# Altium project miStepper.PrjPcb
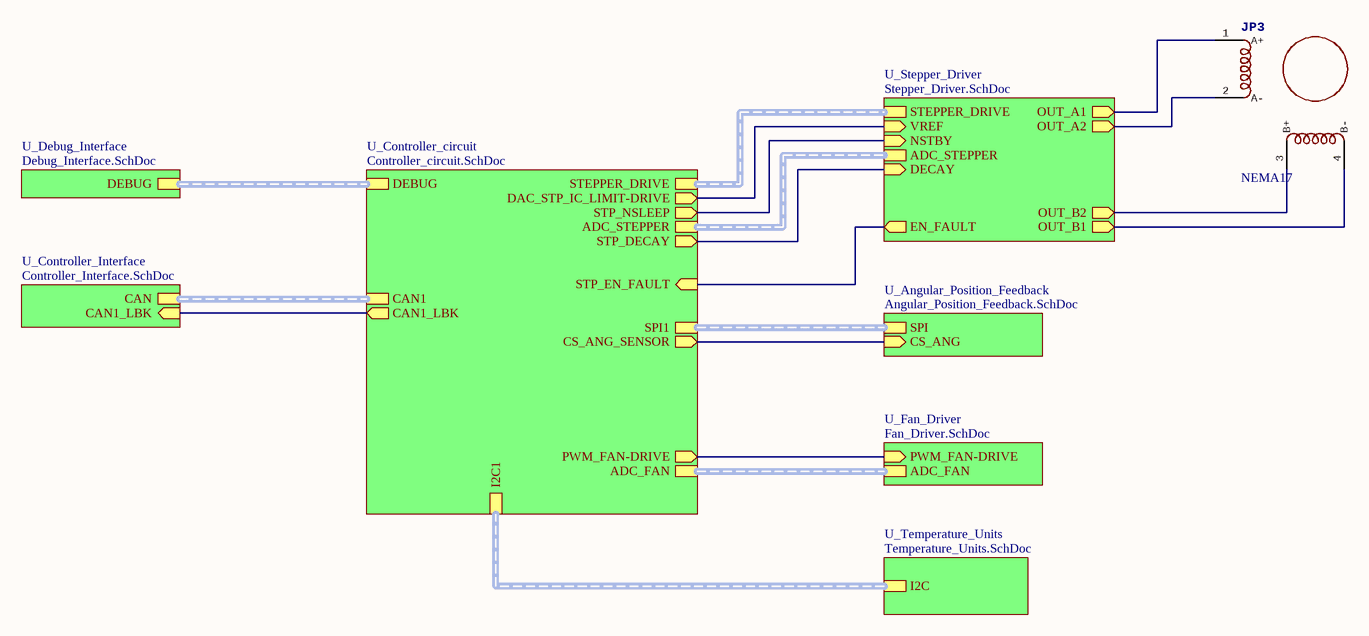
[diagram p0: Top_level.SchDoc]
9 sheets, 69 parts. Net scope: hierarchical (ports join the sheet entries above them; power ports are global).
Sheets:
  Top_level.SchDoc
    U_Controller_circuit = Controller_circuit.SchDoc
    U_Debug_Interface = Debug_Interface.SchDoc
    U_Controller_Interface = Controller_Interface.SchDoc
    U_Fan_Driver = Fan_Driver.SchDoc
      C = Current_Draw_Circuit.SchDoc
    U_Temperature_Units = Temperature_Units.SchDoc
    U_Stepper_Driver = Stepper_Driver.SchDoc
      A = Current_Draw_Circuit.SchDoc
    U_Angular_Position_Feedback = Angular_Position_Feedback.SchDoc

## Sheet Top_level.SchDoc: Top Level
size A4; DocumentNumber: 1; SheetNumber: 1; SheetTotal: 8

### Parts
JP3  NEMA17  [S4B-PH-SM4-TB(LF)(SN)]

### Sub-sheets
U_Angular_Position_Feedback = Angular_Position_Feedback.SchDoc: SPI (harness SPI_Harness), CS_ANG (in)
U_Controller_circuit = Controller_circuit.SchDoc: DEBUG (harness Debug_Harness), I2C1 (harness I2C_Harness), CAN1 (harness CAN_Harness), ADC_STEPPER (harness ADC_STEPPER), ADC_FAN (harness ADC_FAN), STEPPER_DRIVE (harness STEPPER_DRIVE), PWM_FAN-DRIVE (out), SPI1 (harness SPI_Harness), DAC_STP_IC_LIMIT-DRIVE (out), STP_EN_FAULT (in), STP_NSLEEP (out), CS_ANG_SENSOR (out), CAN1_LBK (out), STP_DECAY (out)
U_Controller_Interface = Controller_Interface.SchDoc: CAN (harness CAN_Harness), CAN1_LBK (in)
U_Debug_Interface = Debug_Interface.SchDoc: DEBUG (harness Debug_Harness)
U_Fan_Driver = Fan_Driver.SchDoc: PWM_FAN-DRIVE (in), ADC_FAN (harness ADC_FAN)
U_Stepper_Driver = Stepper_Driver.SchDoc: STEPPER_DRIVE (harness STEPPER_DRIVE), VREF (in), NSTBY (in), ADC_STEPPER (harness ADC_STEPPER), OUT_A1 (out), OUT_A2 (out), OUT_B2 (out), OUT_B1 (out), EN_FAULT (out), DECAY (in)
U_Temperature_Units = Temperature_Units.SchDoc: I2C (harness I2C_Harness)

### Nets
CS_ANG_SENSOR: sheet U_Controller_circuit/CS_ANG_SENSOR, sheet U_Angular_Position_Feedback/CS_ANG
DAC_STP_IC_LIMIT-DRIVE: sheet U_Controller_circuit/DAC_STP_IC_LIMIT-DRIVE, sheet U_Stepper_Driver/VREF
PWM_FAN-DRIVE: sheet U_Controller_circuit/PWM_FAN-DRIVE, sheet U_Fan_Driver/PWM_FAN-DRIVE
STP_DECAY: sheet U_Controller_circuit/STP_DECAY, sheet U_Stepper_Driver/DECAY
STP_EN_FAULT: sheet U_Controller_circuit/STP_EN_FAULT, sheet U_Stepper_Driver/EN_FAULT
STP_NSLEEP: sheet U_Controller_circuit/STP_NSLEEP, sheet U_Stepper_Driver/NSTBY
NetJP3_1: JP3.1(A+) ; sheet U_Stepper_Driver/OUT_A1
NetJP3_2: JP3.2(A-) ; sheet U_Stepper_Driver/OUT_A2
NetJP3_3: JP3.3(B+) ; sheet U_Stepper_Driver/OUT_B2
NetJP3_4: JP3.4(B-) ; sheet U_Stepper_Driver/OUT_B1
NetU1_41: sheet U_Controller_circuit/CAN1_LBK, sheet U_Controller_Interface/CAN1_LBK

### Buses and harness runs
harness sheet U_Angular_Position_Feedback/SPI = sheet U_Controller_circuit/SPI1
harness sheet U_Controller_circuit/ADC_FAN = sheet U_Fan_Driver/ADC_FAN
harness sheet U_Controller_circuit/ADC_STEPPER = sheet U_Stepper_Driver/ADC_STEPPER
harness sheet U_Controller_circuit/CAN1 = sheet U_Controller_Interface/CAN
harness sheet U_Controller_circuit/DEBUG = sheet U_Debug_Interface/DEBUG
harness sheet U_Controller_circuit/I2C1 = sheet U_Temperature_Units/I2C
harness sheet U_Controller_circuit/STEPPER_DRIVE = sheet U_Stepper_Driver/STEPPER_DRIVE

### Notes on the sheet
- Title
- Size:
- Date:
- A4
- Number:
- Time:
- Revision:
- Sheet
- of
- File:

### Library data of the parts
JP3 = NEMA17: Stepper Motor

## Sheet Controller_circuit.SchDoc: Controller circuit
size A4; Author: Thomas Carrington; DocumentNumber: 2; Revision: 2.1; SheetNumber: 2; SheetTotal: 8
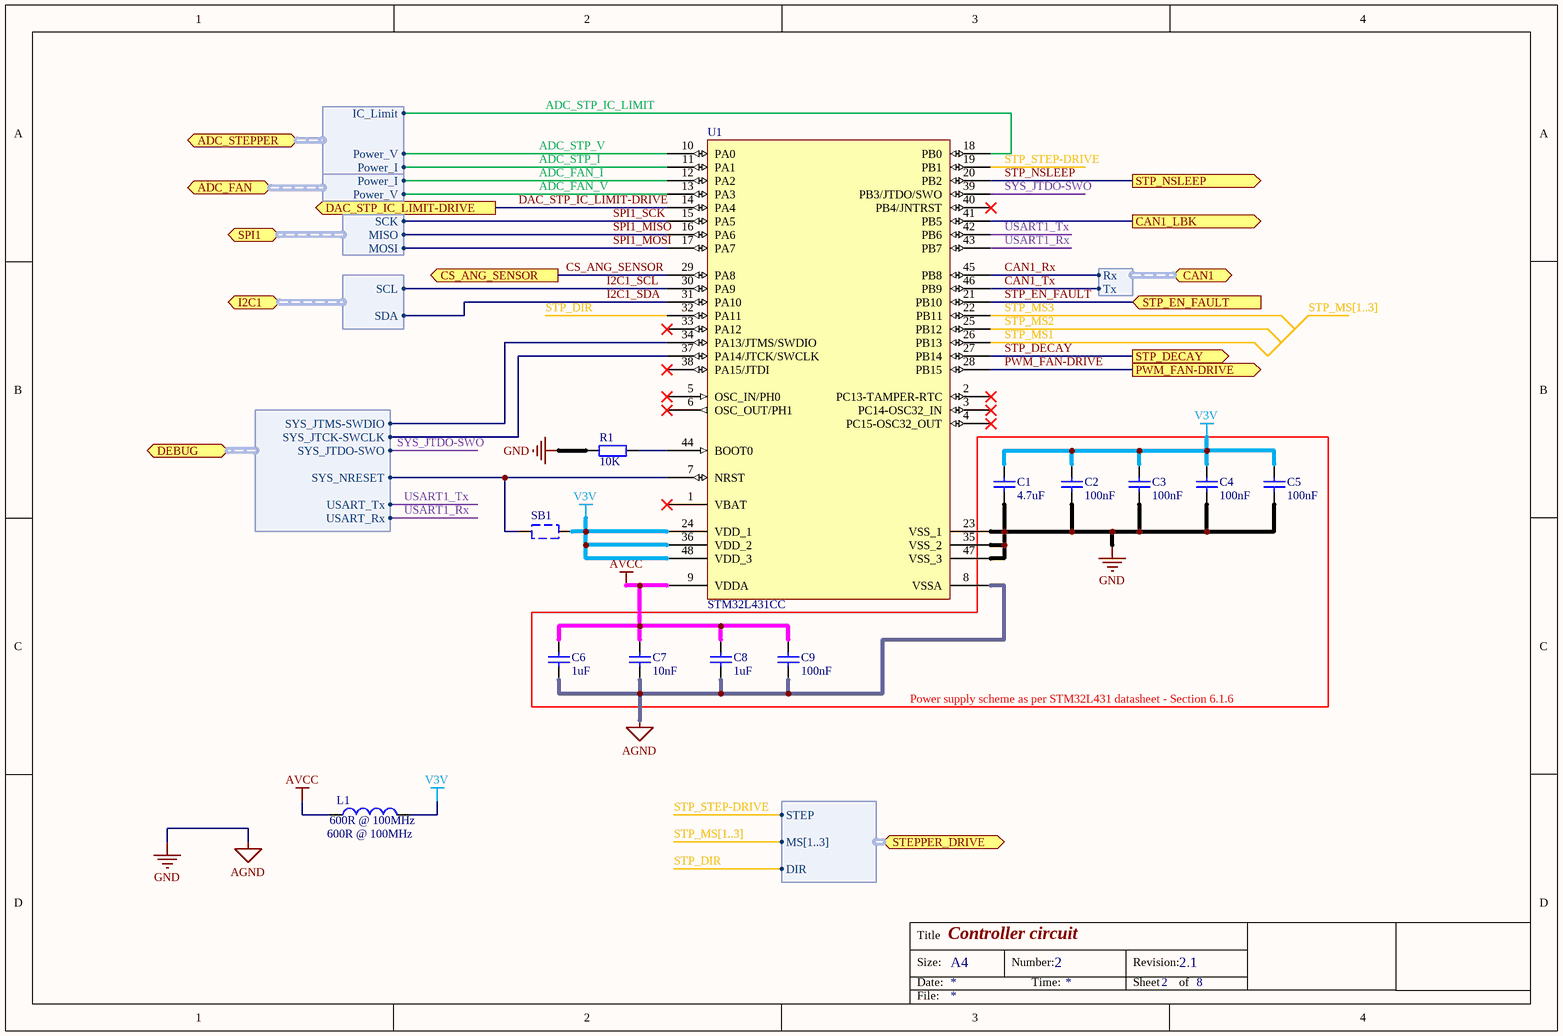
[diagram p1: Controller_circuit.SchDoc]

### Parts
C1  value 4.7uF  [CAPC1608X06N (0603)]  (hidden comment: Cap Semi)
C2  value 100nF  [CAPC1608X06N (0603)]  (hidden comment: Cap Semi)
C3  value 100nF  [CAPC1608X06N (0603)]  (hidden comment: Cap Semi)
C4  value 100nF  [CAPC1608X06N (0603)]  (hidden comment: Cap Semi)
C5  value 100nF  [CAPC1608X06N (0603)]  (hidden comment: Cap Semi)
C6  value 1uF  [CAPC1608X06N (0603)]  (hidden comment: Cap Semi)
C7  value 10nF  [CAPC1608X06N (0603)]  (hidden comment: Cap Semi)
C8  value 1uF  [CAPC1608X06N (0603)]  (hidden comment: Cap Semi)
C9  value 100nF  [CAPC1608X06N (0603)]  (hidden comment: Cap Semi)
L1  600R @ 100MHz  [INDC1608X06N]
R1  value 10K  [RESC1608X06N (0603)]  (hidden comment: Res)
SB1  Option_Res  [RESC1608X06N (0603)]  (value not drawn)
U1  STM32L431CC  [LQFP48_L]

### Ports
ADC_FAN (harness ADC_FAN), ADC_STEPPER (harness ADC_STEPPER), CAN1 (harness CAN_Harness), CAN1_LBK (out), CS_ANG_SENSOR (out), DAC_STP_IC_LIMIT-DRIVE (out), DEBUG (harness Debug_Harness), I2C1 (harness I2C_Harness), PWM_FAN-DRIVE (out), SPI1 (harness SPI_Harness), STEPPER_DRIVE (harness STEPPER_DRIVE), STP_DECAY (out), STP_EN_FAULT (in), STP_NSLEEP (out)

### Harnesses
Debug_Harness: SYS_NRESET, SYS_JTCK-SWCLK, SYS_JTMS-SWDIO, USART_Tx, USART_Rx, SYS_JTDO-SWO
I2C_Harness: SCL, SDA
CAN_Harness: Tx, Rx
ADC_STEPPER: Power_V, Power_I, IC_Limit
ADC_FAN: Power_V, Power_I
STEPPER_DRIVE: STEP, MS[1..3], DIR
SPI_Harness: SCK, MISO, MOSI

### Nets
AGND: C1.1 C2.1 C3.1 C4.1 C5.1 C6.1 C7.1 C8.1 C9.1 R1.1 U1.8(VSSA) U1.23(VSS_1) U1.35(VSS_2) U1.47(VSS_3)  [also labelled GND]
AVCC: C6.2 C7.2 C8.2 C9.2 L1.1 U1.9(VDDA)
V3V: C1.2 C2.2 C3.2 C4.2 C5.2 L1.2 SB1.2 U1.24(VDD_1) U1.36(VDD_2) U1.48(VDD_3)
ADC_FAN_I: U1.12(PA2) ; port ADC_FAN.Power_I
ADC_FAN_V: U1.13(PA3) ; port ADC_FAN.Power_V
ADC_STP_I: U1.11(PA1) ; port ADC_STEPPER.Power_I
ADC_STP_IC_LIMIT: U1.18(PB0) ; port ADC_STEPPER.IC_Limit
ADC_STP_V: U1.10(PA0) ; port ADC_STEPPER.Power_V
CAN1_Rx: U1.45(PB8) ; port CAN1.Rx
CAN1_Tx: U1.46(PB9) ; port CAN1.Tx
CS_ANG_SENSOR: U1.29(PA8) ; port CS_ANG_SENSOR
DAC_STP_IC_LIMIT-DRIVE: U1.14(PA4) ; port DAC_STP_IC_LIMIT-DRIVE
I2C1_SCL: U1.30(PA9) ; port I2C1.SCL
I2C1_SDA: U1.31(PA10) ; port I2C1.SDA
PWM_FAN-DRIVE: U1.28(PB15) ; port PWM_FAN-DRIVE
SPI1_MISO: U1.16(PA6) ; port SPI1.MISO
SPI1_MOSI: U1.17(PA7) ; port SPI1.MOSI
SPI1_SCK: U1.15(PA5) ; port SPI1.SCK
STP_DECAY: U1.27(PB14) ; port STP_DECAY
STP_DIR: U1.32(PA11) ; port STEPPER_DRIVE.DIR  [project net DIR]
STP_EN_FAULT: U1.21(PB10) ; port STP_EN_FAULT
STP_MS1: U1.26(PB13)  [project net MS1]
STP_MS2: U1.25(PB12)  [project net MS2]
STP_MS3: U1.22(PB11)  [project net MS3]
STP_NSLEEP: U1.20(PB2) ; port STP_NSLEEP
STP_STEP-DRIVE: U1.19(PB1) ; port STEPPER_DRIVE.STEP  [project net STEP]
SYS_JTCK-SWCLK: U1.37(PA14/JTCK/SWCLK) ; port DEBUG.SYS_JTCK-SWCLK
SYS_JTDO-SWO: U1.39(PB3/JTDO/SWO) ; port DEBUG.SYS_JTDO-SWO
SYS_JTMS-SWDIO: U1.34(PA13/JTMS/SWDIO) ; port DEBUG.SYS_JTMS-SWDIO
SYS_NRESET: SB1.1 U1.7(NRST) ; port DEBUG.SYS_NRESET
USART1_Rx: U1.43(PB7) ; port DEBUG.USART_Rx
USART1_Tx: U1.42(PB6) ; port DEBUG.USART_Tx
NetR1_2: R1.2 U1.44(BOOT0)
NetU1_41: U1.41(PB5) ; port CAN1_LBK

Not connected (* = marked no-connect by the designer): U1 1(VBAT)* 2(PC13-TAMPER-RTC)* 3(PC14-OSC32_IN)* 4(PC15-OSC32_OUT)* 5(OSC_IN/PH0)* 6(OSC_OUT/PH1)* 33(PA12)* 38(PA15/JTDI)* 40(PB4/JNTRST)*

### Buses and harness runs
bus STP_MS[1..3]

### Notes on the sheet
- (near C6) Tantalum or Ceramic Capacitor
  (1uF)
- (near C7) Ceramic Capacitor
  (10nF)
- Power supply scheme as per STM32L431 datasheet - Section 6.1.6
- Title
- Size:
- Date:
- A4
- Number:
- Time:
- Revision:
- Sheet
- of
- File:

### Library data of the parts
C1-C9 = Cap Semi: Capacitor (Semiconductor SIM Model); Published: 8-Jun-2000; LatestRevisionDate: 29-May-2009; LatestRevisionNote: IPC-7351 Footprint Added.; PackageReference: X7R; Publisher: Altium Limited; PackageDescription: Chip Capacitor
L1 = Ferrite Bead: Inductor with ferrite bead; Farnell_Product: https://uk.farnell.com/tdk/mmz1608b601ct/ferrite-bead-600r-0-5a-0603/dp/2800753; Value: 600R @ 100MHz
R1 = Res: Resistor; Published: 8-Jun-2000; LatestRevisionDate: 17-Jul-2002; LatestRevisionNote: Re-released for DXP Platform.; PackageReference: MCWR06; Publisher: Altium Limited; PackageDescription: SMD Chip Resistor
SB1 = Option_Resistor: Resistor; Published: 8-Jun-2000; LatestRevisionDate: 17-Jul-2002; LatestRevisionNote: Re-released for DXP Platform.; PackageReference: MCWR06; Publisher: Altium Limited; PackageDescription: SMD Chip Resistor
U1 = STM32L431CC: STM32 ARM-based 32-bit MCU with 32 Kbytes Flash, 48-pin LQFP, Industrial Temperature; Published: 30-May-2008; DatasheetVersion: rev6, Mar-2008; PackageVersion: Mar-2008; PackageReference: LQFP48; Publisher: Altium Limited; PackageDescription: 48-Pin Low-Profile Quad Flat Pack, 7 x 7 mm Body, 0.5 mm Pitch (LQFP48); ComponentLink1Description: Manufacturer Link; ComponentLink1URL: www.st.com/stm32; ComponentLink2Description: Datasheet; ComponentLink2URL: https://www.st.com/resource/en/datasheet/stm32l431cb.pdf

## Sheet Debug_Interface.SchDoc: Debug Interface
size A4; Author: Thomas Carrington; DocumentNumber: 6; Revision: 1.1; SheetNumber: 6; SheetTotal: 8
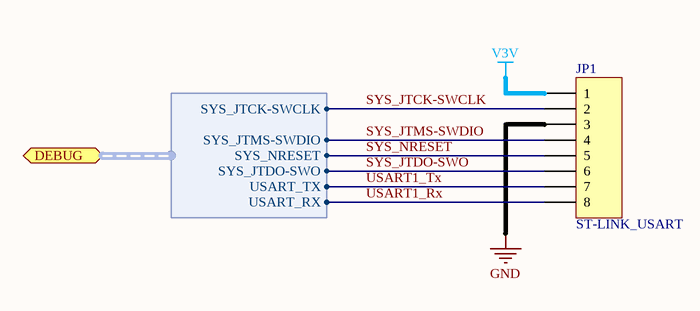
[diagram p2: Debug_Interface.SchDoc]

### Parts
JP1  ST-LINK_USART  [MHDR1X8]

### Ports
DEBUG (harness Debug_Harness)

### Harnesses
Debug_Harness: SYS_JTCK-SWCLK, SYS_JTDO-SWO, SYS_JTMS-SWDIO, SYS_NRESET, USART_RX, USART_TX

### Nets
GND: JP1.3  [project net AGND]
V3V: JP1.1
SYS_JTCK-SWCLK: JP1.2 ; port DEBUG.SYS_JTCK-SWCLK
SYS_JTDO-SWO: JP1.6 ; port DEBUG.SYS_JTDO-SWO
SYS_JTMS-SWDIO: JP1.4 ; port DEBUG.SYS_JTMS-SWDIO
SYS_NRESET: JP1.5 ; port DEBUG.SYS_NRESET
USART1_Rx: JP1.8 ; port DEBUG.USART_RX
USART1_Tx: JP1.7 ; port DEBUG.USART_TX

### Notes on the sheet
- Title
- Size:
- Date:
- A4
- Number:
- Time:
- Revision:
- Sheet
- of
- File:

### Library data of the parts
JP1 = MHDR1X8: Header, 8-Pin; LatestRevisionDate: 17-Jul-2002; LatestRevisionNote: Re-released for DXP Platform.; Publisher: Altium Limited

## Sheet Controller_Interface.SchDoc: Board Interfaces
size A4; DocumentNumber: 7; SheetNumber: 7; SheetTotal: 8
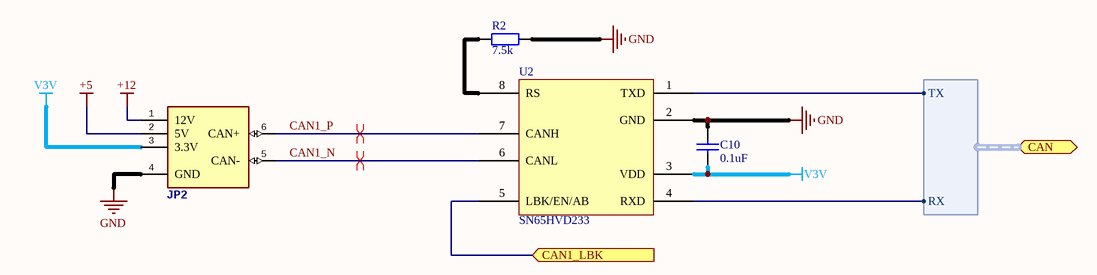
[diagram p3: Controller_Interface.SchDoc]

### Parts
C10  value 0.1uF  [CAPC1608X06N (0603)]  (hidden comment: Cap Semi)
JP2  JST PH Series, 2mm Pitch 6 Way 1 Row Right Angle PCB Header, Solder Termination, 2A   Source:  Datasheet  [S6B-PH-SM4-TB(LF)(SN)]  (value not drawn)
R2  value 7.5k  [RESC1608X06N (0603)]  (hidden comment: Res)
U2  SN65HVD233  [SOIC127P600X175-8N]

### Ports
CAN1_LBK (in), CAN (harness CAN_Harness)

### Harnesses
CAN_Harness: RX, TX

### Nets
+5: JP2.2(5V)
+12: JP2.1(12V)
GND: C10.2 JP2.4(GND) R2.2 U2.2(GND)  [project net AGND]
V3V: C10.1 JP2.3(3.3V) U2.3(VDD)
CAN1_N: JP2.5(CAN-) U2.6(CANL)
CAN1_P: JP2.6(CAN+) U2.7(CANH)
CAN1_Rx: U2.4(RXD) ; port CAN.RX
CAN1_Tx: U2.1(TXD) ; port CAN.TX
NetR2_1: R2.1 U2.8(RS)
NetU1_41: U2.5(LBK/EN/AB) ; port CAN1_LBK

### Layout directives
differential pair: CAN1_N, CAN1_P

### Notes on the sheet
- Title
- Size:
- Date:
- A4
- Number:
- Time:
- Revision:
- Sheet
- of
- File:

### Library data of the parts
C10 = Cap Semi: Capacitor (Semiconductor SIM Model); Published: 8-Jun-2000; LatestRevisionDate: 29-May-2009; LatestRevisionNote: IPC-7351 Footprint Added.; PackageReference: X7R; Publisher: Altium Limited; PackageDescription: Chip Capacitor
JP2 = miStepper-Connector: Custom header for miStepper; Manufacturer_Name: JST (JAPAN SOLDERLESS TERMINALS); Farnell_Part_Number: 9492658; Farnell_Price-Stock: http://uk.farnell.com/jsp/displayProduct.jsp?sku=9492658&action=view; Manufacturer_Part_Number: S6B-PH-SM4-TB(LF)(SN); Height: mm
R2 = Res: Resistor; Published: 8-Jun-2000; LatestRevisionDate: 17-Jul-2002; LatestRevisionNote: Re-released for DXP Platform.; PackageReference: MCWR06; Publisher: Altium Limited; PackageDescription: SMD Chip Resistor
U2 = SN65HVD23x: 3.3V CAN Bus Transceiver; Manufacturer: Texas Instruments

## Sheet Fan_Driver.SchDoc: Fan_Driver
size A4; Author: Thomas Carrington; DocumentNumber: 4; Revision: 2.1; SheetNumber: 4; SheetTotal: 8
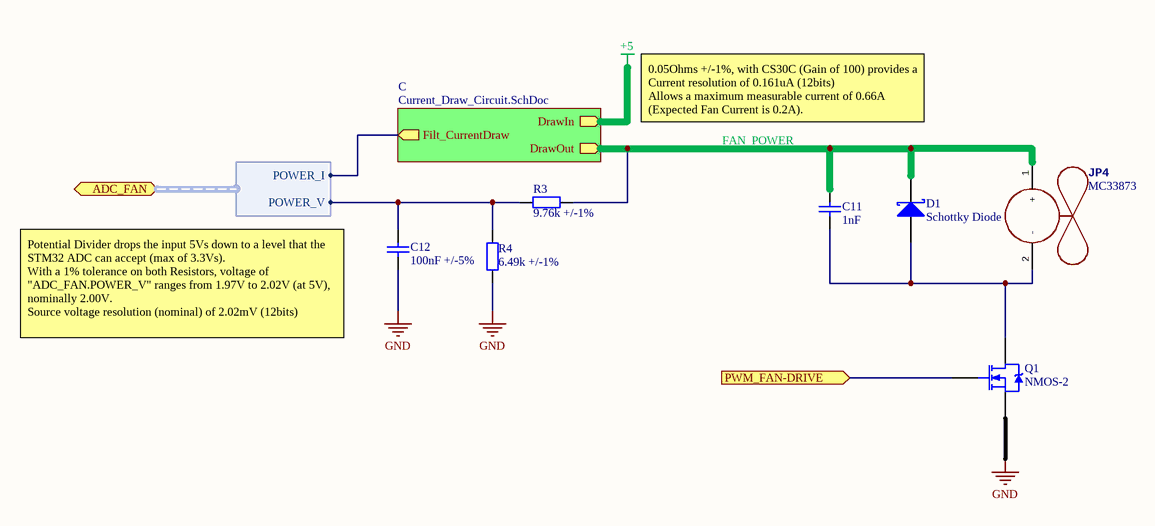
[diagram p4: Fan_Driver.SchDoc]

### Parts
C11  value 1nF  [CAPC1608X06N (0603)]  (hidden comment: Cap Semi)
C12  value 100nF +/-5%  [CAPC1608X06N (0603)]  (hidden comment: Cap Semi)
D1  Schottky Diode  [SODFL350X115-2N]
JP4  MC33873  [JP1Y]
Q1  NMOS-2  [SOT230P700X180-4N]
R3  value 9.76k +/-1%  [RESC1608X06N (0603)]  (hidden comment: Res)
R4  value 6.49k +/-1%  [RESC1608X06N (0603)]  (hidden comment: Res)

### Sub-sheets
C = Current_Draw_Circuit.SchDoc: Filt_CurrentDraw (out), DrawIn, DrawOut

### Ports
ADC_FAN (harness ADC_FAN), PWM_FAN-DRIVE (in)

### Harnesses
ADC_FAN: POWER_I, POWER_V

### Nets
GND: C12.1 Q1.3(S) R4.1  [project net AGND]
ADC_FAN_I: sheet C/Filt_CurrentDraw, port ADC_FAN.POWER_I
ADC_FAN_V: C12.2 R3.1 R4.2 ; port ADC_FAN.POWER_V
FAN_POWER: C11.2 D1.1(K) JP4.1(+) R3.2 ; sheet C/DrawOut
PWM_FAN-DRIVE: Q1.1(G) ; port PWM_FAN-DRIVE
NetC11_1: C11.1 D1.2(A) JP4.2(-) Q1.2(D)

### Notes on the sheet
- 0.05Ohms +/-1%, with CS30C (Gain of 100) provides a Current resolution of 0.161uA (12bits)
  Allows a maximum measurable current of 0.66A (Expected Fan Current is 0.2A).
- Potential Divider drops the input 5Vs down to a level that the STM32 ADC can accept (max of 3.3Vs).
  With a 1% tolerance on both Resistors, voltage of "ADC_FAN.POWER_V" ranges from 1.97V to 2.02V (at 5V), nominally 2.00V.
  Source voltage resolution (nominal) of 2.02mV (12bits)
- Title
- Size:
- Date:
- A4
- Number:
- Time:
- Revision:
- Sheet
- of
- File:

### Library data of the parts
C11 C12 = Cap Semi: Capacitor (Semiconductor SIM Model); Published: 8-Jun-2000; LatestRevisionDate: 29-May-2009; LatestRevisionNote: IPC-7351 Footprint Added.; PackageReference: X7R; Publisher: Altium Limited; PackageDescription: Chip Capacitor
D1 = Diode: Schottky Rectifier; Note: Terminal 2 is the TAB and is electrically connected to the cathode; Published: 8-Jun-2000; LatestRevisionDate: 17-Jul-2002; LatestRevisionNote: Re-released for DXP Platform.; DatasheetVersion: PD-2.057B; PackageVersion: Feb-1998; PackageReference: TO-220AC; Publisher: Altium Limited; PackageDescription: TO, Thru-Hole, Vertical, Heatsink Mounted; 3 In-Line Leads (1 Absent); Pitch 2.54 mm; ComponentLink1Description: Manufacturer Link; ComponentLink1URL: http://www.irf.com/; ComponentLink2Description: Datasheet; ComponentLink2URL: http://www.irf.com/product-info/datasheets/data/10tq.pdf
JP4 = MC33873: Motor; Header Datasheet: https://uk.farnell.com/multicomp/mc34745/header-1-row-r-angle-2way/dp/1593426?st=2.54mm%20headere
Q1 = NMOS-2: N-Channel Power MOSFET; Note: Pin 2 is electrically connected to pin 4.; Published: 8-Jun-2000; LatestRevisionDate: 17-Jul-2002; LatestRevisionNote: Re-released for DXP Platform.; DatasheetVersion: PD-9.814; PackageVersion: Feb-1997; PackageReference: TO-220AB; Publisher: Altium Limited; PackageDescription: TO, Thru-Hole, Vertical, Heatsink Mounted; 3 In-Line Leads; Pitch 2.54 mm; ComponentLink1Description: Manufacturer Link; ComponentLink1URL: http://www.irf.com/
R3 R4 = Res: Resistor; Published: 8-Jun-2000; LatestRevisionDate: 17-Jul-2002; LatestRevisionNote: Re-released for DXP Platform.; PackageReference: MCWR06; Publisher: Altium Limited; PackageDescription: SMD Chip Resistor

## Sheet Current_Draw_Circuit.SchDoc: Current Draw Sensor
size A4
Used 2 times, as channels U_Fan_Driver/C, U_Stepper_Driver/A. Parts and nets are listed once, with the designators drawn on the sheet.
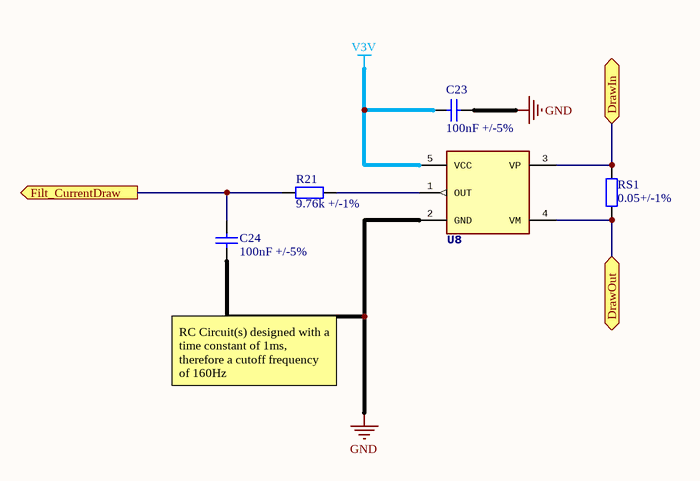
[diagram p5: Current_Draw_Circuit.SchDoc]

### Parts
C23  value 100nF +/-5%  [CAPC1608X06N (0603)]  (hidden comment: Cap Semi)
C24  value 100nF +/-5%  [CAPC1608X06N (0603)]  (hidden comment: Cap Semi)
R21  value 9.76k +/-1%  [RESC1608X06N (0603)]  (hidden comment: Res)
RS1  value 0.05+/-1%  [RESC2012X06N (0805)]  (hidden comment: Res)
U8  CS30xL  [SOT95P280X145-5N]  (value not drawn)

### Ports
DrawIn, DrawOut, Filt_CurrentDraw (out)

### Nets
GND: C23.1 C24.1 U8.2(GND)
V3V: C23.2 U8.5(VCC)
DrawIn: RS1.2 U8.3(VP) ; port DrawIn
DrawOut: RS1.1 U8.4(VM) ; port DrawOut
Filt_CurrentDraw: C24.2 R21.1 ; port Filt_CurrentDraw
NetR21_2: R21.2 U8.1(OUT)

### Channels
U_Fan_Driver/C: designators end in _$ChannelName#1; ports DrawIn=+5 DrawOut=FAN_POWER Filt_CurrentDraw=ADC_FAN_I
U_Stepper_Driver/A: designators end in _$ChannelName#2; ports DrawIn=+12 DrawOut=STEPPER_POWER Filt_CurrentDraw=ADC_STP_I

### Notes on the sheet
- RC Circuit(s) designed with a time constant of 1ms, therefore a cutoff frequency of 160Hz
- Title
- Size:
- Date:
- A4
- Number:
- Time:
- Revision:
- Sheet
- of
- File:

### Library data of the parts
C23 C24 = Cap Semi: Capacitor (Semiconductor SIM Model); Published: 8-Jun-2000; LatestRevisionDate: 29-May-2009; LatestRevisionNote: IPC-7351 Footprint Added.; PackageReference: X7R; Publisher: Altium Limited; PackageDescription: Chip Capacitor
R21 RS1 = Res: Resistor; Published: 8-Jun-2000; LatestRevisionDate: 17-Jul-2002; LatestRevisionNote: Re-released for DXP Platform.; PackageReference: MCWR06; Publisher: Altium Limited; PackageDescription: SMD Chip Resistor
U8 = CS30xL: High side current sense high voltage op amp; Manufacturer_Name: STMicroelectronics; Allied_Number: 70602615; Manufacturer_Part_Number: CS30xL; Mouser_Part_Number: 511-CS30xL; Mouser_Price-Stock: https://www.mouser.com/Search/Refine.aspx?Keyword=511-CS30BL; RS_Part_Number: 8607514; RS_Price-Stock: https://uk.rs-online.com/web/p/products/8607514; Allied_Price-Stock: http://www.alliedelec.com/stmicroelectronics-cs30bl/70602615/; Height: 1.45mm

## Sheet Temperature_Units.SchDoc: Temperature Unit
size A4; Author: Thomas Carrington; DocumentNumber: 5; Revision: 1.1; SheetNumber: 5; SheetTotal: 8
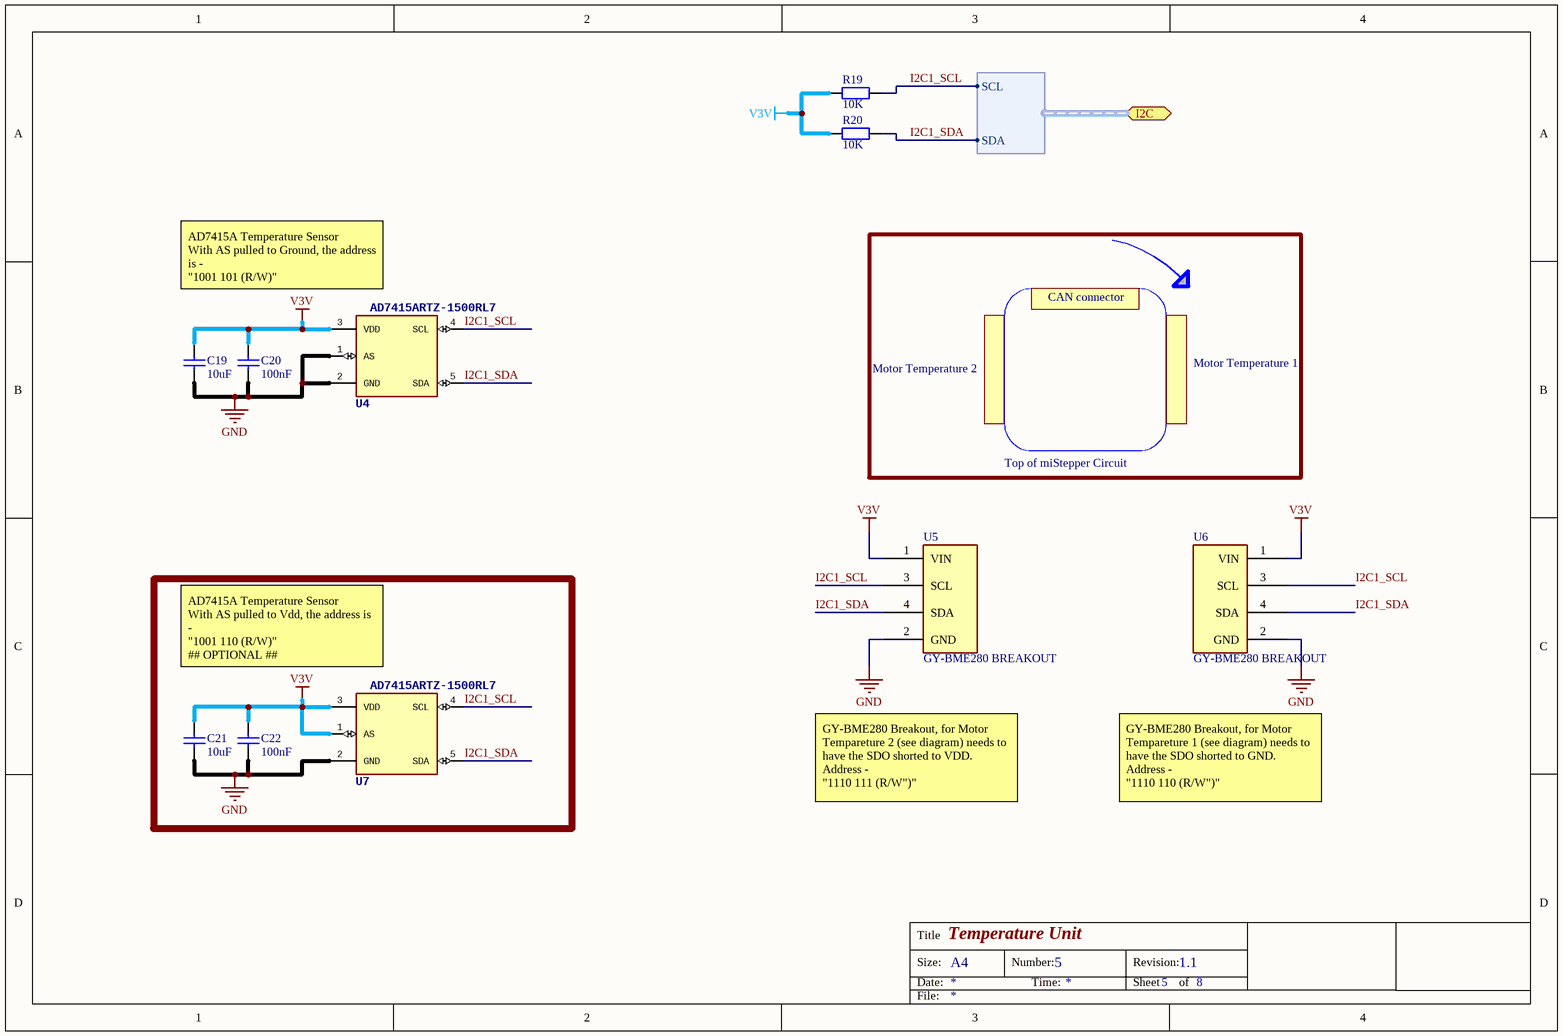
[diagram p6: Temperature_Units.SchDoc]

### Parts
C19  value 10uF  [CAPC1608X06N (0603)]  (hidden comment: Cap Semi)
C20  value 100nF  [CAPC1608X06N (0603)]  (hidden comment: Cap Semi)
C21  value 10uF  [CAPC1608X06N (0603)]  (hidden comment: Cap Semi)
C22  value 100nF  [CAPC1608X06N (0603)]  (hidden comment: Cap Semi)
R19  value 10K  [RESC1608X06N (0603)]  (hidden comment: Res)
R20  value 10K  [RESC1608X06N (0603)]  (hidden comment: Res)
U4  AD7415ARTZ-1500RL7  [SOT95P280X145-5N]
U5  GY-BME280 BREAKOUT  [GY-BME280 BREAKOUT]
U6  GY-BME280 BREAKOUT  [GY-BME280 BREAKOUT]
U7  AD7415ARTZ-1500RL7  [SOT95P280X145-5N]

### Ports
I2C (harness I2C_Harness)

### Harnesses
I2C_Harness: SCL, SDA

### Nets
GND: C19.1 C20.1 C21.1 C22.1 U4.1(AS) U4.2(GND) U5.2(GND) U6.2(GND) U7.2(GND)  [project net AGND]
V3V: C19.2 C20.2 C21.2 C22.2 R19.2 R20.2 U4.3(VDD) U5.1(VIN) U6.1(VIN) U7.1(AS) U7.3(VDD)
I2C1_SCL: R19.1 U4.4(SCL) U5.3(SCL) U6.3(SCL) U7.4(SCL) ; port I2C.SCL
I2C1_SDA: R20.1 U4.5(SDA) U5.4(SDA) U6.4(SDA) U7.5(SDA) ; port I2C.SDA

### Notes on the sheet
- (near U4) AD7415A Temperature Sensor
  With AS pulled to Ground, the address is -
  "1001 101 (R/W)"
- CAN connector
- Motor Temperature 2
- Motor Temperature 1
- Top of miStepper Circuit
- (near U7) AD7415A Temperature Sensor
  With AS pulled to Vdd, the address is -
  "1001 110 (R/W)"
  ## OPTIONAL ##
- GY-BME280 Breakout, for Motor Tempareture 2 (see diagram) needs to have the SDO shorted to VDD.
  Address -
  "1110 111 (R/W")"
- GY-BME280 Breakout, for Motor Tempareture 1 (see diagram) needs to have the SDO shorted to GND.
  Address -
  "1110 110 (R/W")"
- Title
- Size:
- Date:
- A4
- Number:
- Time:
- Revision:
- Sheet
- of
- File:

### Library data of the parts
C19-C22 = Cap Semi: Capacitor (Semiconductor SIM Model); Published: 8-Jun-2000; LatestRevisionDate: 29-May-2009; LatestRevisionNote: IPC-7351 Footprint Added.; PackageReference: X7R; Publisher: Altium Limited; PackageDescription: Chip Capacitor
R19 R20 = Res: Resistor; Published: 8-Jun-2000; LatestRevisionDate: 17-Jul-2002; LatestRevisionNote: Re-released for DXP Platform.; PackageReference: MCWR06; Publisher: Altium Limited; PackageDescription: SMD Chip Resistor
U4 U7 = AD7415ARTZ-1500RL7: I2C Temperature Sensor; Manufacturer_Name: Analog Devices; Manufacturer_Part_Number: AD7415ARTZ-1500RL7; Mouser_Part_Number: 584-AD7415ARTZ1500R7; Mouser_Price-Stock: https://www.mouser.com/Search/Refine.aspx?Keyword=584-AD7415ARTZ0500R7; RS_Part_Number: 6977035P; RS_Price-Stock: http://uk.rs-online.com/web/p/products/6977035P; Height: 1.45mm

## Sheet Stepper_Driver.SchDoc: Stepper Driver
size A4; DocumentNumber: 3; SheetNumber: 3; SheetTotal: 8
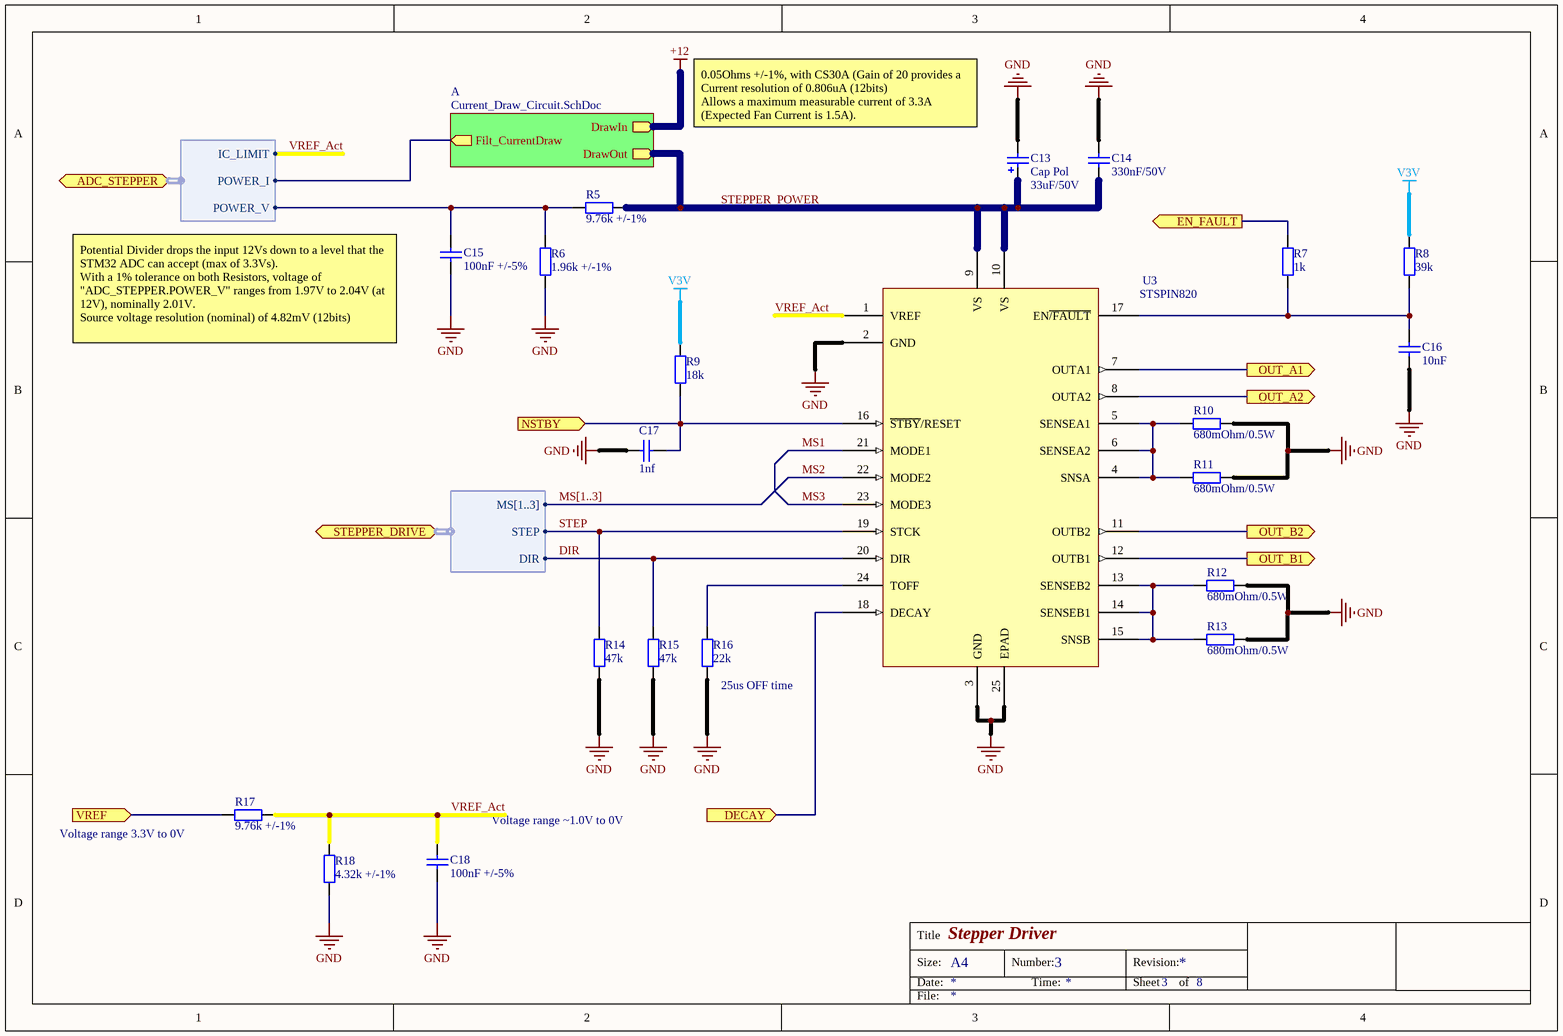
[diagram p7: Stepper_Driver.SchDoc]

### Parts
C13  Cap Pol  value 33uF/50V  [CAPAE7066X77M]
C14  value 330nF/50V  [CAPC3216X06N (1206)]  (hidden comment: Cap Semi)
C15  value 100nF +/-5%  [CAPC1608X06N (0603)]  (hidden comment: Cap Semi)
C16  value 10nF  [CAPC1608X06N (0603)]  (hidden comment: Cap Semi)
C17  value 1nf  [CAPC1608X06N (0603)]  (hidden comment: Cap Semi)
C18  value 100nF +/-5%  [CAPC1608X06N (0603)]  (hidden comment: Cap Semi)
R5  value 9.76k +/-1%  [RESC1608X06N (0603)]  (hidden comment: Res)
R6  value 1.96k +/-1%  [RESC1608X06N (0603)]  (hidden comment: Res)
R7  value 1k  [RESC1608X06N (0603)]  (hidden comment: Res)
R8  value 39k  [RESC1608X06N (0603)]  (hidden comment: Res)
R9  value 18k  [RESC1608X06N (0603)]  (hidden comment: Res)
R10  value 680mOhm/0.5W  [RESC2012X06N (0805)]  (hidden comment: Res)
R11  value 680mOhm/0.5W  [RESC2012X06N (0805)]  (hidden comment: Res)
R12  value 680mOhm/0.5W  [RESC2012X06N (0805)]  (hidden comment: Res)
R13  value 680mOhm/0.5W  [RESC2012X06N (0805)]  (hidden comment: Res)
R14  value 47k  [RESC1608X06N (0603)]  (hidden comment: Res)
R15  value 47k  [RESC1608X06N (0603)]  (hidden comment: Res)
R16  value 22k  [RESC1608X06N (0603)]  (hidden comment: Res)
R17  value 9.76k +/-1%  [RESC1608X06N (0603)]  (hidden comment: Res)
R18  value 4.32k +/-1%  [RESC1608X06N (0603)]  (hidden comment: Res)
U3  STSPIN820  [QFN50P400X400X110-25N]

### Sub-sheets
A = Current_Draw_Circuit.SchDoc: Filt_CurrentDraw (out), DrawIn, DrawOut

### Ports
ADC_STEPPER (harness ADC_STEPPER), DECAY (in), EN_FAULT (out), NSTBY (in), OUT_A1 (out), OUT_A2 (out), OUT_B1 (out), OUT_B2 (out), STEPPER_DRIVE (harness STEPPER_DRIVE), VREF (in)

### Harnesses
STEPPER_DRIVE: DIR, MS[1..3], STEP
ADC_STEPPER: IC_LIMIT, POWER_I, POWER_V

### Nets
GND: C13.2 C14.1 C15.1 C16.2 C17.2 C18.1 R6.1 R10.2 R11.2 R12.2 R13.2 R14.2 R15.2 R16.2 R18.1 U3.2(GND) U3.3(GND) U3.25(EPAD)  [project net AGND]
V3V: R8.2 R9.2
ADC_STP_I: sheet A/Filt_CurrentDraw, port ADC_STEPPER.POWER_I
ADC_STP_V: C15.2 R5.1 R6.2 ; port ADC_STEPPER.POWER_V
DAC_STP_IC_LIMIT-DRIVE: R17.1 ; port VREF
DIR: R15.1 U3.20(DIR) ; port STEPPER_DRIVE.DIR
MS1: U3.21(MODE1)
MS2: U3.22(MODE2)
MS3: U3.23(MODE3)
STEP: R14.1 U3.19(STCK) ; port STEPPER_DRIVE.STEP
STEPPER_POWER: C13.1 C14.2 R5.2 U3.9(VS) U3.10(VS) ; sheet A/DrawOut
STP_DECAY: U3.18(DECAY) ; port DECAY
STP_EN_FAULT: R7.2 ; port EN_FAULT
STP_NSLEEP: C17.1 R9.1 U3.16(~{STBY}/RESET) ; port NSTBY
VREF_Act: C18.2 R17.2 R18.2 U3.1(VREF) ; port ADC_STEPPER.IC_LIMIT  [project net ADC_STP_IC_LIMIT]
NetC16_1: C16.1 R7.1 R8.1 U3.17(EN~{/FAULT})
NetJP3_1: U3.7(OUTA1) ; port OUT_A1
NetJP3_2: U3.8(OUTA2) ; port OUT_A2
NetJP3_3: U3.11(OUTB2) ; port OUT_B2
NetJP3_4: U3.12(OUTB1) ; port OUT_B1
NetR10_1: R10.1 R11.1 U3.4(SNSA) U3.5(SENSEA1) U3.6(SENSEA2)
NetR12_1: R12.1 R13.1 U3.13(SENSEB2) U3.14(SENSEB1) U3.15(SNSB)
NetR16_1: R16.1 U3.24(TOFF)

### Buses and harness runs
bus MS[1..3]

### Notes on the sheet
- (near C13) 0.05Ohms +/-1%, with CS30A (Gain of 20 provides a Current resolution of 0.806uA (12bits)
  Allows a maximum measurable current of 3.3A (Expected Fan Current is 1.5A).
- Potential Divider drops the input 12Vs down to a level that the STM32 ADC can accept (max of 3.3Vs).
  With a 1% tolerance on both Resistors, voltage of "ADC_STEPPER.POWER_V" ranges from 1.97V to 2.04V (at 12V), nominally 2.01V.
  Source voltage resolution (nominal) of 4.82mV (12bits)
- (near R16) 25us OFF time
- (near R17) Voltage range 3.3V to 0V
- Voltage range ~1.0V to 0V
- Title
- Size:
- Date:
- A4
- Number:
- Time:
- Revision:
- Sheet
- of
- File:

### Library data of the parts
C13 = Cap Pol: Polarized Capacitor (Surface Mount); Published: 8-Jun-2000; LatestRevisionDate: 29-May-2009; LatestRevisionNote: IPC-7351 Footprint Added.; PackageReference: C0805; Publisher: Altium Limited; PackageDescription: Chip Capacitor
C14-C18 = Cap Semi: Capacitor (Semiconductor SIM Model); Published: 8-Jun-2000; LatestRevisionDate: 29-May-2009; LatestRevisionNote: IPC-7351 Footprint Added.; PackageReference: X7R; Publisher: Altium Limited; PackageDescription: Chip Capacitor
R5-R18 = Res: Resistor; Published: 8-Jun-2000; LatestRevisionDate: 17-Jul-2002; LatestRevisionNote: Re-released for DXP Platform.; PackageReference: MCWR06; Publisher: Altium Limited; PackageDescription: SMD Chip Resistor
U3 = STSPIN820: Stepper IC

## Sheet Angular_Position_Feedback.SchDoc: Angular Position Feedback
size A4
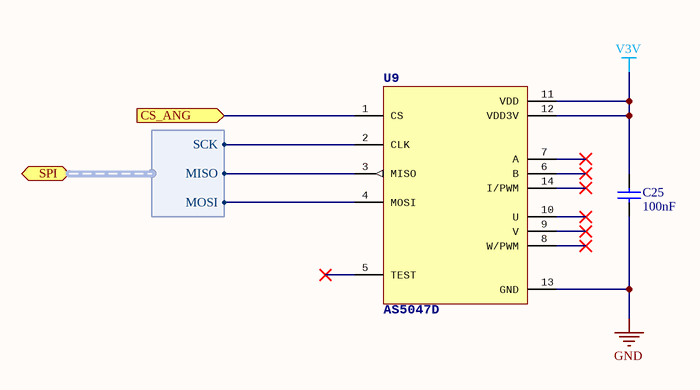
[diagram p8: Angular_Position_Feedback.SchDoc]

### Parts
C25  value 100nF  [CAPC1608X06N (0603)]  (hidden comment: Cap Semi)
U9  AS5047D  [TSSOP14]

### Ports
CS_ANG (in), SPI (harness SPI_Harness)

### Harnesses
SPI_Harness: MISO, MOSI, SCK

### Nets
GND: C25.1 U9.13(GND)  [project net AGND]
V3V: C25.2 U9.11(VDD) U9.12(VDD3V)
CS_ANG_SENSOR: U9.1(CS) ; port CS_ANG
SPI1_MISO: U9.3(MISO) ; port SPI.MISO
SPI1_MOSI: U9.4(MOSI) ; port SPI.MOSI
SPI1_SCK: U9.2(CLK) ; port SPI.SCK

Not connected (* = marked no-connect by the designer): U9 5(TEST)* 6(B)* 7(A)* 8(W/PWM)* 9(V)* 10(U)* 14(I/PWM)*

### Notes on the sheet
- Title
- Size:
- Date:
- A4
- Number:
- Time:
- Revision:
- Sheet
- of
- File:

### Library data of the parts
C25 = Cap Semi: Capacitor (Semiconductor SIM Model); Published: 8-Jun-2000; LatestRevisionDate: 29-May-2009; LatestRevisionNote: IPC-7351 Footprint Added.; PackageReference: X7R; Publisher: Altium Limited; PackageDescription: Chip Capacitor

## Nets that join several sheets
+5: Controller_Interface (JP2.2), U_Fan_Driver/C (RS1_$ChannelName#1.2 U8_$ChannelName#1.3)
+12: Controller_Interface (JP2.1), U_Stepper_Driver/A (RS1_$ChannelName#2.2 U8_$ChannelName#2.3)
AGND: Controller_circuit (14 pins), Debug_Interface (JP1.3), Controller_Interface (C10.2 JP2.4 R2.2 U2.2), Fan_Driver (C12.1 Q1.3 R4.1), U_Fan_Driver/C (C23_$ChannelName#1.1 C24_$ChannelName#1.1 U8_$ChannelName#1.2), Temperature_Units (9 pins), Stepper_Driver (18 pins), U_Stepper_Driver/A (C23_$ChannelName#2.1 C24_$ChannelName#2.1 U8_$ChannelName#2.2), Angular_Position_Feedback (C25.1 U9.13)
V3V: Controller_circuit (10 pins), Debug_Interface (JP1.1), Controller_Interface (C10.1 JP2.3 U2.3), U_Fan_Driver/C (C23_$ChannelName#1.2 U8_$ChannelName#1.5), Temperature_Units (11 pins), Stepper_Driver (R8.2 R9.2), U_Stepper_Driver/A (C23_$ChannelName#2.2 U8_$ChannelName#2.5), Angular_Position_Feedback (C25.2 U9.11 U9.12)
ADC_FAN_I: Controller_circuit (U1.12), U_Fan_Driver/C (C24_$ChannelName#1.2 R21_$ChannelName#1.1)
ADC_FAN_V: Controller_circuit (U1.13), Fan_Driver (C12.2 R3.1 R4.2)
ADC_STP_I: Controller_circuit (U1.11), U_Stepper_Driver/A (C24_$ChannelName#2.2 R21_$ChannelName#2.1)
ADC_STP_IC_LIMIT: Controller_circuit (U1.18), Stepper_Driver (C18.2 R17.2 R18.2 U3.1)
ADC_STP_V: Controller_circuit (U1.10), Stepper_Driver (C15.2 R5.1 R6.2)
CAN1_Rx: Controller_circuit (U1.45), Controller_Interface (U2.4)
CAN1_Tx: Controller_circuit (U1.46), Controller_Interface (U2.1)
CS_ANG_SENSOR: Controller_circuit (U1.29), Angular_Position_Feedback (U9.1)
DAC_STP_IC_LIMIT-DRIVE: Controller_circuit (U1.14), Stepper_Driver (R17.1)
DIR: Controller_circuit (U1.32), Stepper_Driver (R15.1 U3.20)
FAN_POWER: Fan_Driver (C11.2 D1.1 JP4.1 R3.2), U_Fan_Driver/C (RS1_$ChannelName#1.1 U8_$ChannelName#1.4)
I2C1_SCL: Controller_circuit (U1.30), Temperature_Units (5 pins)
I2C1_SDA: Controller_circuit (U1.31), Temperature_Units (5 pins)
MS1: Controller_circuit (U1.26), Stepper_Driver (U3.21)
MS2: Controller_circuit (U1.25), Stepper_Driver (U3.22)
MS3: Controller_circuit (U1.22), Stepper_Driver (U3.23)
NetJP3_1: Top_level (JP3.1), Stepper_Driver (U3.7)
NetJP3_2: Top_level (JP3.2), Stepper_Driver (U3.8)
NetJP3_3: Top_level (JP3.3), Stepper_Driver (U3.11)
NetJP3_4: Top_level (JP3.4), Stepper_Driver (U3.12)
NetU1_41: Controller_circuit (U1.41), Controller_Interface (U2.5)
PWM_FAN-DRIVE: Controller_circuit (U1.28), Fan_Driver (Q1.1)
SPI1_MISO: Controller_circuit (U1.16), Angular_Position_Feedback (U9.3)
SPI1_MOSI: Controller_circuit (U1.17), Angular_Position_Feedback (U9.4)
SPI1_SCK: Controller_circuit (U1.15), Angular_Position_Feedback (U9.2)
STEP: Controller_circuit (U1.19), Stepper_Driver (R14.1 U3.19)
STEPPER_POWER: Stepper_Driver (5 pins), U_Stepper_Driver/A (RS1_$ChannelName#2.1 U8_$ChannelName#2.4)
STP_DECAY: Controller_circuit (U1.27), Stepper_Driver (U3.18)
STP_EN_FAULT: Controller_circuit (U1.21), Stepper_Driver (R7.2)
STP_NSLEEP: Controller_circuit (U1.20), Stepper_Driver (C17.1 R9.1 U3.16)
SYS_JTCK-SWCLK: Controller_circuit (U1.37), Debug_Interface (JP1.2)
SYS_JTDO-SWO: Controller_circuit (U1.39), Debug_Interface (JP1.6)
SYS_JTMS-SWDIO: Controller_circuit (U1.34), Debug_Interface (JP1.4)
SYS_NRESET: Controller_circuit (SB1.1 U1.7), Debug_Interface (JP1.5)
USART1_Rx: Controller_circuit (U1.43), Debug_Interface (JP1.8)
USART1_Tx: Controller_circuit (U1.42), Debug_Interface (JP1.7)